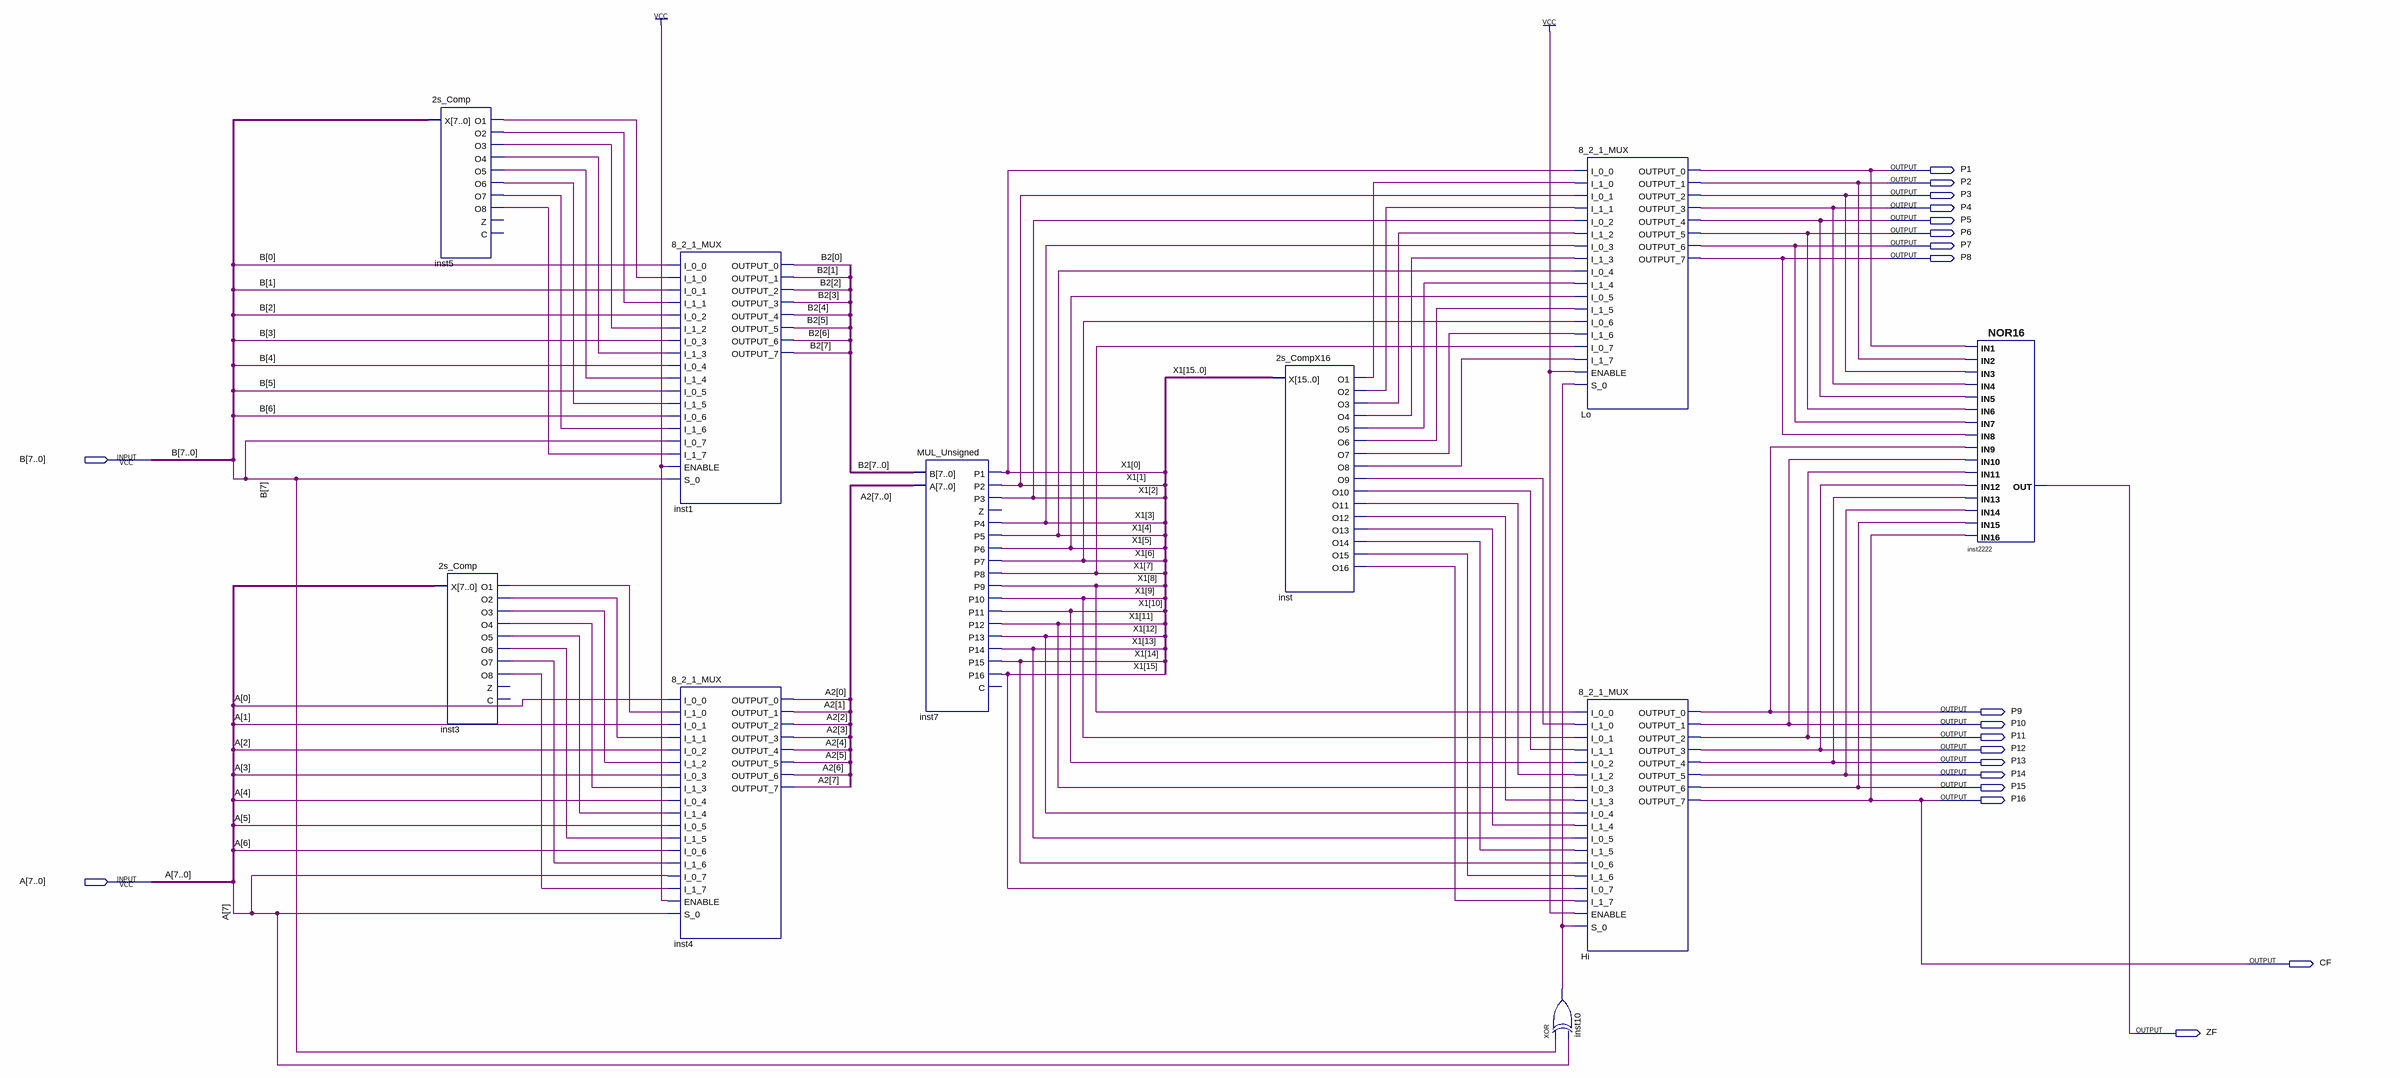
[diagram p0: schematic sheet]
// Quartus schematic MULS_2.bdf as structural Verilog: 10 symbols, 20 pins
module MULS_2 (
  input  [7:0] B,
  input  [7:0] A,
  output P1,
  output P2,
  output P3,
  output P4,
  output P5,
  output P6,
  output P7,
  output P8,
  output P9,
  output P10,
  output P11,
  output P12,
  output P13,
  output P14,
  output P15,
  output P16,
  output CF,
  output ZF
);

  wire inst3_o1, inst3_o2, inst3_o3, inst3_o4, inst3_o5, inst3_o6, inst3_o7, inst3_o8, inst5_o1, inst5_o2,
       inst5_o3, inst5_o4, inst5_o5, inst5_o6, inst5_o7, inst5_o8, inst10_out, inst_o1, inst_o2, inst_o3,
       inst_o4, inst_o5, inst_o6, inst_o7, inst_o8, inst_o9, inst_o10, inst_o11, inst_o12, inst_o13,
       inst_o14, inst_o15, inst_o16;
  wire [7:0] A2, B2;
  wire [15:0] X1;

  \2s_Comp  inst5 (
    .X(B), .O1(inst5_o1), .O2(inst5_o2), .O3(inst5_o3), .O4(inst5_o4), .O5(inst5_o5), .O6(inst5_o6),
    .O7(inst5_o7), .O8(inst5_o8));  // open: Z, C
  \2s_Comp  inst3 (
    .X(A), .O1(inst3_o1), .O2(inst3_o2), .O3(inst3_o3), .O4(inst3_o4), .O5(inst3_o5), .O6(inst3_o6),
    .O7(inst3_o7), .O8(inst3_o8));  // open: Z, C
  \8_2_1_MUX  inst1 (
    .I_0_0(B[0]), .I_1_0(inst5_o1), .I_0_1(B[1]), .I_1_1(inst5_o2), .I_0_2(B[2]), .I_1_2(inst5_o3),
    .I_0_3(B[3]), .I_1_3(inst5_o4), .I_0_4(B[4]), .I_1_4(inst5_o5), .I_0_5(B[5]), .I_1_5(inst5_o6),
    .I_0_6(B[6]), .I_1_6(inst5_o7), .I_0_7(B[7]), .I_1_7(inst5_o8), .ENABLE(1'b1), .S_0(B[7]),
    .OUTPUT_0(B2[0]), .OUTPUT_1(B2[1]), .OUTPUT_2(B2[2]), .OUTPUT_3(B2[3]), .OUTPUT_4(B2[4]),
    .OUTPUT_5(B2[5]), .OUTPUT_6(B2[6]), .OUTPUT_7(B2[7]));
  \8_2_1_MUX  inst4 (
    .I_0_0(A[0]), .I_1_0(inst3_o1), .I_0_1(A[1]), .I_1_1(inst3_o2), .I_0_2(A[2]), .I_1_2(inst3_o3),
    .I_0_3(A[3]), .I_1_3(inst3_o4), .I_0_4(A[4]), .I_1_4(inst3_o5), .I_0_5(A[5]), .I_1_5(inst3_o6),
    .I_0_6(A[6]), .I_1_6(inst3_o7), .I_0_7(A[7]), .I_1_7(inst3_o8), .ENABLE(1'b1), .S_0(A[7]),
    .OUTPUT_0(A2[0]), .OUTPUT_1(A2[1]), .OUTPUT_2(A2[2]), .OUTPUT_3(A2[3]), .OUTPUT_4(A2[4]),
    .OUTPUT_5(A2[5]), .OUTPUT_6(A2[6]), .OUTPUT_7(A2[7]));
  MUL_Unsigned inst7 (
    .B(B2), .A(A2), .P1(X1[0]), .P2(X1[1]), .P3(X1[2]), .P4(X1[3]), .P5(X1[4]), .P6(X1[5]), .P7(X1[6]),
    .P8(X1[7]), .P9(X1[8]), .P10(X1[9]), .P11(X1[10]), .P12(X1[11]), .P13(X1[12]), .P14(X1[13]),
    .P15(X1[14]), .P16(X1[15]));  // open: Z, C
  \2s_CompX16  inst (
    .X(X1), .O1(inst_o1), .O2(inst_o2), .O3(inst_o3), .O4(inst_o4), .O5(inst_o5), .O6(inst_o6), .O7(inst_o7),
    .O8(inst_o8), .O9(inst_o9), .O10(inst_o10), .O11(inst_o11), .O12(inst_o12), .O13(inst_o13),
    .O14(inst_o14), .O15(inst_o15), .O16(inst_o16));
  xor inst10 (inst10_out, B[7], A[7]);
  \8_2_1_MUX  Lo (
    .I_0_0(X1[0]), .I_1_0(inst_o1), .I_0_1(X1[1]), .I_1_1(inst_o2), .I_0_2(X1[2]), .I_1_2(inst_o3),
    .I_0_3(X1[3]), .I_1_3(inst_o4), .I_0_4(X1[4]), .I_1_4(inst_o5), .I_0_5(X1[5]), .I_1_5(inst_o6),
    .I_0_6(X1[6]), .I_1_6(inst_o7), .I_0_7(X1[7]), .I_1_7(inst_o8), .ENABLE(1'b1), .S_0(inst10_out),
    .OUTPUT_0(P1), .OUTPUT_1(P2), .OUTPUT_2(P3), .OUTPUT_3(P4), .OUTPUT_4(P5), .OUTPUT_5(P6), .OUTPUT_6(P7),
    .OUTPUT_7(P8));
  \8_2_1_MUX  Hi (
    .I_0_0(X1[8]), .I_1_0(inst_o9), .I_0_1(X1[9]), .I_1_1(inst_o10), .I_0_2(X1[10]), .I_1_2(inst_o11),
    .I_0_3(X1[11]), .I_1_3(inst_o12), .I_0_4(X1[12]), .I_1_4(inst_o13), .I_0_5(X1[13]), .I_1_5(inst_o14),
    .I_0_6(X1[14]), .I_1_6(inst_o15), .I_0_7(X1[15]), .I_1_7(inst_o16), .ENABLE(1'b1), .S_0(inst10_out),
    .OUTPUT_0(P9), .OUTPUT_1(P10), .OUTPUT_2(P11), .OUTPUT_3(P12), .OUTPUT_4(P13), .OUTPUT_5(P14),
    .OUTPUT_6(P15), .OUTPUT_7(CF));
  nor inst2222 (ZF, P1, P2, P3, P4, P5, P6, P7, P8, P9, P10, P11, P12, P13, P14, P15, CF);

  assign P16 = CF;
endmodule
